# Altium schematic sheet LED.SchDoc: LED ws2812 Heart - LED
size 279 x 215 mm; Engineer: Henry Tonoyan (htonoyan.blogspot.com); Revision: 1; SheetNumber: 2; SheetTotal: 2
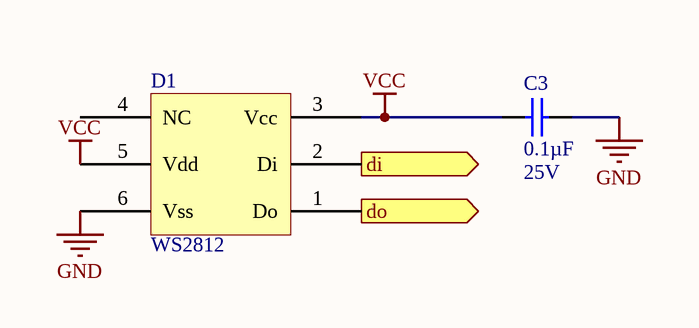
[diagram p0: LED.SchDoc]

## Parts
C3  Capacitance: 0.1µF  Voltage - Rated: 25V  [0603]  (hidden comment: CAP CER .10UF 25V X7R 10% 0603)
D1  WS2812  [LED_5050]

## Ports
di (in), do (out)

## Nets
GND: C3.2 D1.6(Vss)
VCC: C3.1 D1.3(Vcc) D1.5(Vdd)
di: D1.2(Di) ; port di
do: D1.1(Do) ; port do

Not connected (* = marked no-connect by the designer): D1 4(NC)

## Notes on the sheet
- Title:
- Size:
- A
- Project:
- File:
- Rev:
- Date:
- Eng:
- Sheet
- of

## Library data of the parts
C3 = CAP_CER_.10UF_25V_X7R_10%_0603_1: Manufacturer: TDK Corporation; Manufacturer Part Number: C1608X7R1E104K; Supplier 1: Digi-Key; RoHS: RoHS Compliant; Category: Capacitors; Stock 1: 1271235; Pricing 1: 1=0.1, 10=0.024, 100=0.011, 250=0.009, 500=0.0077, 1000=0.006 (USD); Tolerance: ±10%; Temperature Coefficient: X7R; Mounting Type: Surface Mount, MLCC; Operating Temperature: -55°C ~ 125°C; Applications: General Purpose; Ratings: -; Package / Case: 0603 (1608 Metric); Size / Dimension: 0.063" L x 0.031" W (1.60mm x 0.80mm); Height - Seated (Max): -; Thickness (Max): 0.037" (0.95mm); Lead Spacing: -; Features: -; Packaging: Cut Tape (CT); Lead Style: -; ComponentLink1URL: http://www.tdk.com/pdf/general_B11.pdf; ComponentLink1Description: Datasheet; Supplier Part Number 1: 445-1316-1-ND